# Altium schematic sheet ESCDown.SchDoc
size A4; SheetNumber: 6; SheetTotal: 6
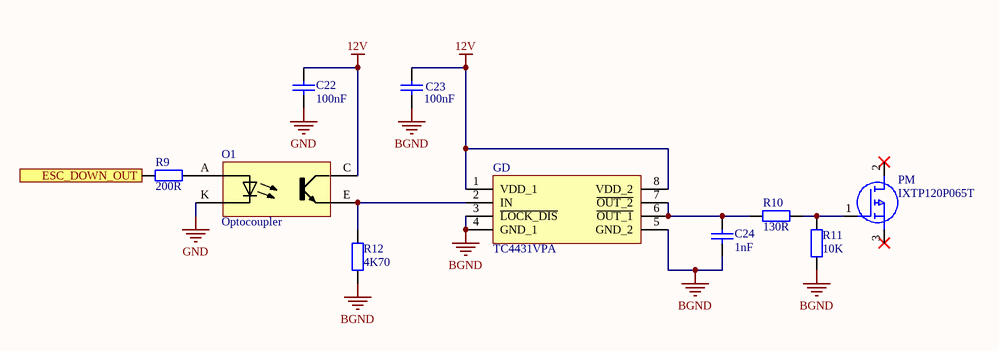
[diagram p0: ESCDown.SchDoc]

## Parts
C22  100nF  [FP_0805_CAP_085]
C23  100nF  [FP_0805_CAP_085]
C24  1nF  [FP_0805_CAP_085]
GD  TC4431VPA  [DIP781W56P254L950H533Q8N]
O1  Optocoupler  [SOP254P1016X400-4N]
PM  IXTP120P065T  [TO254P483X1028X2284-3P - extended]
R9  200R  [FP_0805_RES]
R10  130R  [FP_0805_RES]
R11  10K  [FP_0805_RES]
R12  4K70  [FP_0805_RES]

## Ports
ESC_DOWN_OUT (in)

## Nets
12V: C22.1 C23.1 GD.1(VDD_1) GD.8(VDD_2) O1.C
BGND: C23.2 C24.1 GD.3(~{LOCK_DIS}) GD.4(GND_1) GD.5(GND_2) R11.1 R12.1
GND: C22.2 O1.K
ESC_DOWN_OUT: R9.2 ; port ESC_DOWN_OUT
NetC24_2: C24.2 GD.6(~{OUT_1}) GD.7(~{OUT_2}) R10.1
NetGD_2: GD.2(IN) O1.E R12.2
NetO1_A: O1.A R9.1
NetPM_1: PM.1(G) R10.2 R11.2

Not connected (* = marked no-connect by the designer): PM 2(D)* 3(S)*

## Library data of the parts
C22-C24 = CAP: Capacitor
  C22 C23: Value: 100nF
  C24: Value: 1nF
GD = TC4431VPA: Microchip TC4431VPA, MOSFET Power Driver 1.5A, 4.5  30 V, Inverting, 8-Pin PDIP; Geometry.Height: 5.334mm; Mouser Part Number: 579-TC4431VPA; Mouser Price/Stock: https://www.mouser.co.uk/ProductDetail/Microchip-Technology/TC4431VPA?qs=dJbzCyn%252BCFb0mSWY4MWPfw%3D%3D; Manufacturer_Name: Microchip; Manufacturer_Part_Number: TC4431VPA; Datasheet Link: http://ww1.microchip.com/downloads/en/DeviceDoc/21424d.pdf
O1 = Optocoupler: pin to pad: A>1 C>4 E>3 K>2; MP: VO615A-9X009T; Package: None; Price: None; Value: *; Availability: Unavailable
PM = IXTP120P065T: POWER MOSFET -120 Amps -65V 0.01 Rds; Manufacturer_Name: LITTELFUSE; Geometry.Height: 4.83mm; Mouser Part Number: 747-IXTP120P065T; Mouser Price/Stock: https://www.mouser.co.uk/ProductDetail/IXYS/IXTP120P065T?qs=cvHLLyFtoE09fNdm%2Fv8mrw%3D%3D; Manufacturer_Part_Number: IXTP120P065T; Datasheet Link: https://m.littelfuse.com/~/media/electronics/datasheets/discrete_mosfets/littelfuse_discrete_mosfets_p-channel_ixt_120p065t_datasheet.pdf.pdf
R9-R12 = RES: Resistor
  R9: Value: 200R
  R10: Value: 130R
  R11: Value: 10K
  R12: Value: 4K70